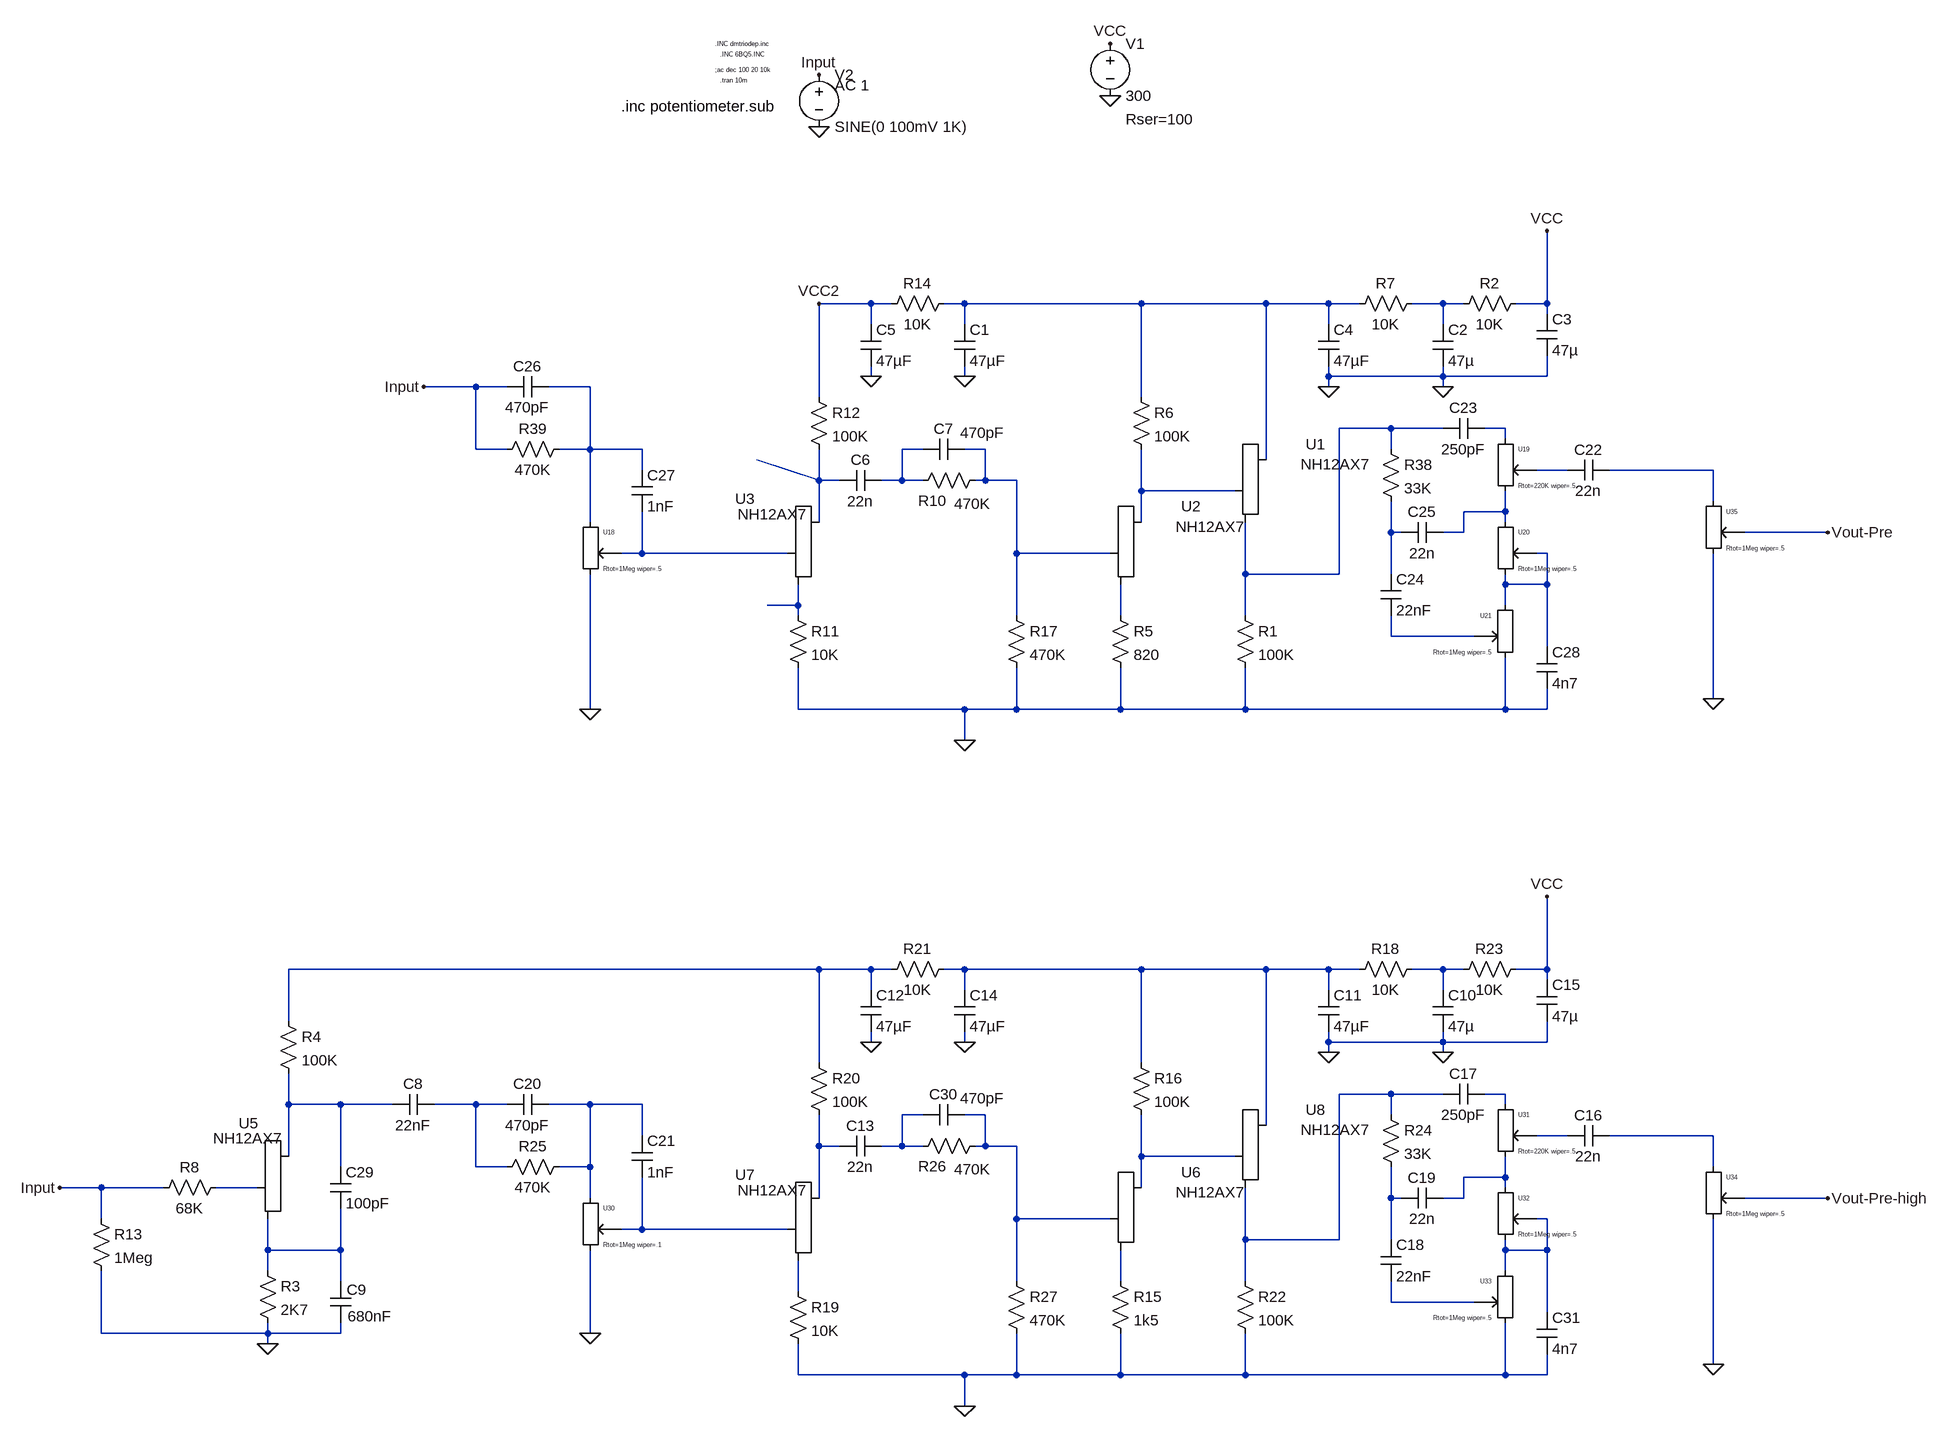
[diagram p0: schematic marshall_JCM800_50W_4010.asc]
marshall_JCM800_50W_4010.asc, the LTspice schematic file:
Version 4
SHEET 1 1260 1524
WIRE -720 -224 -800 -224
WIRE -688 -224 -720 -224
WIRE -576 -224 -608 -224
WIRE -304 -224 -576 -224
WIRE -112 -224 -304 -224
WIRE -16 -224 -112 -224
WIRE 32 -224 -16 -224
WIRE 160 -224 112 -224
WIRE 192 -224 160 -224
WIRE 320 -224 320 -336
WIRE 320 -224 272 -224
WIRE 320 -208 320 -224
WIRE -720 -192 -720 -224
WIRE -576 -192 -576 -224
WIRE -16 -192 -16 -224
WIRE 160 -192 160 -224
WIRE -720 -112 -720 -128
WIRE -576 -112 -576 -128
WIRE -16 -112 -16 -128
WIRE 160 -112 160 -128
WIRE 160 -112 -16 -112
WIRE 320 -112 320 -144
WIRE 320 -112 160 -112
WIRE -1328 -96 -1408 -96
WIRE -1280 -96 -1328 -96
WIRE -1152 -96 -1216 -96
WIRE -16 -96 -16 -112
WIRE 160 -96 160 -112
WIRE -800 -80 -800 -224
WIRE -304 -80 -304 -224
WIRE 80 -32 0 -32
WIRE 160 -32 80 -32
WIRE 256 -32 224 -32
WIRE 256 -16 256 -32
WIRE -1328 0 -1328 -96
WIRE -1280 0 -1328 0
WIRE -1152 0 -1152 -96
WIRE -1152 0 -1200 0
WIRE -1072 0 -1152 0
WIRE -640 0 -672 0
WIRE -544 0 -576 0
WIRE 80 0 80 -32
WIRE -112 16 -112 -224
WIRE -1072 32 -1072 0
WIRE 352 32 304 32
WIRE 576 32 416 32
WIRE -800 48 -800 0
WIRE -800 48 -896 16
WIRE -768 48 -800 48
WIRE -672 48 -672 0
WIRE -672 48 -704 48
WIRE -640 48 -672 48
WIRE -544 48 -544 0
WIRE -544 48 -560 48
WIRE -496 48 -544 48
WIRE -304 64 -304 0
WIRE -160 64 -304 64
WIRE 576 80 576 32
WIRE 256 96 256 64
WIRE 256 96 192 96
WIRE -1152 112 -1152 0
WIRE -800 112 -800 48
WIRE -304 112 -304 64
WIRE 256 112 256 96
WIRE 80 128 80 80
WIRE 96 128 80 128
WIRE 192 128 192 96
WIRE 192 128 160 128
WIRE 752 128 624 128
WIRE -1072 160 -1072 96
WIRE -1072 160 -1104 160
WIRE -848 160 -1072 160
WIRE -496 160 -496 48
WIRE -352 160 -496 160
WIRE 320 160 304 160
WIRE -144 192 -144 112
WIRE 0 192 0 -32
WIRE 0 192 -144 192
WIRE 80 192 80 128
WIRE 256 208 256 192
WIRE 320 208 320 160
WIRE 320 208 256 208
WIRE -832 240 -832 208
WIRE -832 240 -880 240
WIRE 256 240 256 208
WIRE -832 256 -832 240
WIRE -496 256 -496 160
WIRE -336 256 -336 208
WIRE -144 256 -144 192
WIRE 80 288 80 256
WIRE 208 288 80 288
WIRE 320 304 320 208
WIRE 576 384 576 160
WIRE -1152 400 -1152 192
WIRE -832 400 -832 336
WIRE -576 400 -832 400
WIRE -496 400 -496 336
WIRE -496 400 -576 400
WIRE -336 400 -336 336
WIRE -336 400 -496 400
WIRE -144 400 -144 336
WIRE -144 400 -336 400
WIRE 256 400 256 320
WIRE 256 400 -144 400
WIRE 320 400 320 368
WIRE 320 400 256 400
WIRE -576 448 -576 400
WIRE -800 800 -1616 800
WIRE -720 800 -800 800
WIRE -688 800 -720 800
WIRE -576 800 -608 800
WIRE -304 800 -576 800
WIRE -112 800 -304 800
WIRE -16 800 -112 800
WIRE 32 800 -16 800
WIRE 160 800 112 800
WIRE 192 800 160 800
WIRE 320 800 320 688
WIRE 320 800 272 800
WIRE 320 816 320 800
WIRE -720 832 -720 800
WIRE -576 832 -576 800
WIRE -16 832 -16 800
WIRE 160 832 160 800
WIRE -1616 880 -1616 800
WIRE -720 912 -720 896
WIRE -576 912 -576 896
WIRE -16 912 -16 896
WIRE 160 912 160 896
WIRE 160 912 -16 912
WIRE 320 912 320 880
WIRE 320 912 160 912
WIRE -16 928 -16 912
WIRE 160 928 160 912
WIRE -800 944 -800 800
WIRE -304 944 -304 800
WIRE 80 992 0 992
WIRE 160 992 80 992
WIRE 256 992 224 992
WIRE -1616 1008 -1616 960
WIRE -1536 1008 -1616 1008
WIRE -1456 1008 -1536 1008
WIRE -1328 1008 -1392 1008
WIRE -1280 1008 -1328 1008
WIRE -1152 1008 -1216 1008
WIRE -1072 1008 -1152 1008
WIRE 256 1008 256 992
WIRE -640 1024 -672 1024
WIRE -544 1024 -576 1024
WIRE 80 1024 80 992
WIRE -112 1040 -112 800
WIRE -1072 1056 -1072 1008
WIRE 352 1056 304 1056
WIRE 576 1056 416 1056
WIRE -800 1072 -800 1024
WIRE -768 1072 -800 1072
WIRE -672 1072 -672 1024
WIRE -672 1072 -704 1072
WIRE -640 1072 -672 1072
WIRE -544 1072 -544 1024
WIRE -544 1072 -560 1072
WIRE -496 1072 -544 1072
WIRE -1616 1088 -1616 1008
WIRE -304 1088 -304 1024
WIRE -160 1088 -304 1088
WIRE -1536 1104 -1536 1008
WIRE -1328 1104 -1328 1008
WIRE -1280 1104 -1328 1104
WIRE -1152 1104 -1152 1008
WIRE -1152 1104 -1200 1104
WIRE 576 1104 576 1056
WIRE 256 1120 256 1088
WIRE 256 1120 192 1120
WIRE -1904 1136 -1968 1136
WIRE -1808 1136 -1904 1136
WIRE -1664 1136 -1728 1136
WIRE -304 1136 -304 1088
WIRE 256 1136 256 1120
WIRE -1152 1152 -1152 1104
WIRE -800 1152 -800 1072
WIRE 80 1152 80 1104
WIRE 96 1152 80 1152
WIRE 192 1152 192 1120
WIRE 192 1152 160 1152
WIRE 752 1152 624 1152
WIRE -1904 1184 -1904 1136
WIRE -496 1184 -496 1072
WIRE -352 1184 -496 1184
WIRE 320 1184 304 1184
WIRE -1072 1200 -1072 1120
WIRE -1072 1200 -1104 1200
WIRE -848 1200 -1072 1200
WIRE -144 1216 -144 1136
WIRE 0 1216 0 992
WIRE 0 1216 -144 1216
WIRE 80 1216 80 1152
WIRE -1648 1232 -1648 1184
WIRE -1536 1232 -1536 1168
WIRE -1536 1232 -1648 1232
WIRE 256 1232 256 1216
WIRE 320 1232 320 1184
WIRE 320 1232 256 1232
WIRE -1648 1264 -1648 1232
WIRE 256 1264 256 1232
WIRE -1536 1280 -1536 1232
WIRE -496 1280 -496 1184
WIRE -336 1280 -336 1232
WIRE -144 1280 -144 1216
WIRE -832 1296 -832 1248
WIRE 80 1312 80 1280
WIRE 208 1312 80 1312
WIRE 320 1328 320 1232
WIRE -1904 1360 -1904 1264
WIRE -1648 1360 -1648 1344
WIRE -1648 1360 -1904 1360
WIRE -1536 1360 -1536 1344
WIRE -1536 1360 -1648 1360
WIRE -1152 1360 -1152 1232
WIRE -1648 1376 -1648 1360
WIRE 576 1408 576 1184
WIRE -832 1424 -832 1376
WIRE -576 1424 -832 1424
WIRE -496 1424 -496 1360
WIRE -496 1424 -576 1424
WIRE -336 1424 -336 1360
WIRE -336 1424 -496 1424
WIRE -144 1424 -144 1360
WIRE -144 1424 -336 1424
WIRE 256 1424 256 1344
WIRE 256 1424 -144 1424
WIRE 320 1424 320 1392
WIRE 320 1424 256 1424
WIRE -576 1472 -576 1424
FLAG 160 -96 0
FLAG -16 -96 0
FLAG -720 -112 0
FLAG -1408 -96 Input
FLAG -576 -112 0
FLAG -800 -576 Input
FLAG -800 -496 0
FLAG -576 448 0
FLAG -1648 1376 0
FLAG 752 128 Vout-Pre
FLAG -1152 400 0
FLAG 320 -336 VCC
FLAG -352 -624 VCC
FLAG -352 -544 0
FLAG -800 -224 VCC2
FLAG 160 928 0
FLAG -16 928 0
FLAG -720 912 0
FLAG -1968 1136 Input
FLAG -576 912 0
FLAG -576 1472 0
FLAG 752 1152 Vout-Pre-high
FLAG -1152 1360 0
FLAG 320 688 VCC
FLAG 576 384 0
FLAG 576 1408 0
DATAFLAG -432 -224 ""
DATAFLAG -304 64 ""
DATAFLAG -48 192 ""
DATAFLAG -1648 1216 ""
DATAFLAG -432 800 ""
DATAFLAG -208 1088 ""
DATAFLAG -96 1216 ""
DATAFLAG -880 240 ""
DATAFLAG -896 16 ""
SYMBOL voltage -352 -640 R0
WINDOW 123 24 112 Left 2
WINDOW 39 24 132 Left 2
SYMATTR SpiceLine Rser=100
SYMATTR InstName V1
SYMATTR Value 300
SYMBOL cap 144 -192 R0
SYMATTR InstName C2
SYMATTR Value 47µ
SYMBOL voltage -800 -592 R0
WINDOW 123 24 32 Left 2
WINDOW 39 0 0 Left 2
SYMATTR Value2 AC 1
SYMATTR InstName V2
SYMATTR Value SINE(0 100mV 1K)
SYMBOL triode -304 160 R0
WINDOW 0 61 -72 Left 2
WINDOW 3 61 -16 Invisible 2
WINDOW 38 53 -41 Left 2
SYMATTR InstName U2
SYMATTR Value ""
SYMATTR SpiceModel NH12AX7
SYMBOL res -352 240 R0
SYMATTR InstName R5
SYMATTR Value 820
SYMBOL res -320 -96 R0
SYMATTR InstName R6
SYMATTR Value 100K
SYMBOL res 16 -208 R270
WINDOW 0 32 56 VTop 2
WINDOW 3 0 56 VBottom 2
SYMATTR InstName R7
SYMATTR Value 10K
SYMBOL cap -32 -192 R0
SYMATTR InstName C4
SYMATTR Value 47µF
SYMBOL res -1824 1152 R270
WINDOW 0 32 56 VTop 2
WINDOW 3 0 56 VBottom 2
SYMATTR InstName R8
SYMATTR Value 68K
SYMBOL triode -800 160 R0
WINDOW 0 -129 -84 Left 2
WINDOW 3 61 -16 Invisible 2
WINDOW 38 -125 -60 Left 2
SYMATTR InstName U3
SYMATTR Value ""
SYMATTR SpiceModel NH12AX7
SYMBOL res -848 240 R0
SYMATTR InstName R11
SYMATTR Value 10K
SYMBOL res -816 -96 R0
SYMATTR InstName R12
SYMATTR Value 100K
SYMBOL res -704 -208 R270
WINDOW 0 32 56 VTop 2
WINDOW 3 0 56 VBottom 2
SYMATTR InstName R14
SYMATTR Value 10K
SYMBOL cap -736 -192 R0
SYMATTR InstName C5
SYMATTR Value 47µF
SYMBOL cap -768 64 R270
WINDOW 0 32 32 VTop 2
WINDOW 3 0 32 VBottom 2
SYMATTR InstName C6
SYMATTR Value 22n
SYMBOL cap -592 -192 R0
SYMATTR InstName C1
SYMATTR Value 47µF
SYMBOL triode -112 64 R0
WINDOW 0 61 -72 Left 2
WINDOW 3 61 -16 Invisible 2
WINDOW 38 53 -41 Left 2
SYMATTR InstName U1
SYMATTR Value ""
SYMATTR SpiceModel NH12AX7
SYMBOL res -160 240 R0
SYMATTR InstName R1
SYMATTR Value 100K
SYMBOL res 176 -208 R270
WINDOW 0 32 56 VTop 2
WINDOW 3 0 56 VBottom 2
SYMATTR InstName R2
SYMATTR Value 10K
SYMBOL cap 304 -208 R0
SYMATTR InstName C3
SYMATTR Value 47µ
SYMBOL triode -1616 1136 R0
WINDOW 0 -77 -99 Left 2
WINDOW 3 61 -16 Invisible 2
WINDOW 38 -116 -76 Left 2
SYMATTR InstName U5
SYMATTR Value ""
SYMATTR SpiceModel NH12AX7
SYMBOL res -1664 1248 R0
SYMATTR InstName R3
SYMATTR Value 2K7
SYMBOL res -1632 864 R0
SYMATTR InstName R4
SYMATTR Value 100K
SYMBOL cap -1520 1344 R180
WINDOW 0 -24 51 Left 2
WINDOW 3 -64 10 Left 2
SYMATTR InstName C9
SYMATTR Value 680nF
SYMBOL cap -1456 1024 R270
WINDOW 0 32 32 VTop 2
WINDOW 3 0 32 VBottom 2
SYMATTR InstName C8
SYMATTR Value 22nF
SYMBOL res -1920 1168 R0
SYMATTR InstName R13
SYMATTR Value 1Meg
SYMBOL cap 352 48 R270
WINDOW 0 32 32 VTop 2
WINDOW 3 0 32 VBottom 2
SYMATTR InstName C22
SYMATTR Value 22n
SYMBOL cap 160 -16 R270
WINDOW 0 32 32 VTop 2
WINDOW 3 0 32 VBottom 2
SYMATTR InstName C23
SYMATTR Value 250pF
SYMBOL res 64 -16 R0
SYMATTR InstName R38
SYMATTR Value 33K
SYMBOL cap 64 192 R0
SYMATTR InstName C24
SYMATTR Value 22nF
SYMBOL cap 96 144 R270
WINDOW 0 32 32 VTop 2
WINDOW 3 0 32 VBottom 2
SYMATTR InstName C25
SYMATTR Value 22n
SYMBOL res -1296 16 R270
WINDOW 0 32 56 VTop 2
WINDOW 3 0 56 VBottom 2
SYMATTR InstName R39
SYMATTR Value 470K
SYMBOL cap -1280 -80 R270
WINDOW 0 32 32 VTop 2
WINDOW 3 0 32 VBottom 2
SYMATTR InstName C26
SYMATTR Value 470pF
SYMBOL potentiometerEU -1168 96 R0
SYMATTR InstName U18
SYMATTR Value Rtot=1Meg wiper=.5
SYMBOL cap -1088 32 R0
SYMATTR InstName C27
SYMATTR Value 1nF
SYMBOL res -656 64 R270
WINDOW 0 -31 31 VTop 2
WINDOW 3 -4 92 VBottom 2
SYMATTR InstName R10
SYMATTR Value 470K
SYMBOL cap -640 16 R270
WINDOW 0 32 32 VTop 2
WINDOW 3 57 92 VBottom 2
SYMATTR InstName C7
SYMATTR Value 470pF
SYMBOL res -512 240 R0
SYMATTR InstName R17
SYMATTR Value 470K
SYMBOL potentiometerEU 240 -32 R0
SYMATTR InstName U19
SYMATTR Value Rtot=220K wiper=.5
SYMBOL potentiometerEU 240 96 R0
SYMATTR InstName U20
SYMATTR Value Rtot=1Meg wiper=.5
SYMBOL potentiometerEU 272 224 M0
SYMATTR InstName U21
SYMATTR Value Rtot=1Meg wiper=.5
SYMBOL cap 304 304 R0
SYMATTR InstName C28
SYMATTR Value 4n7
SYMBOL cap -1552 1104 R0
SYMATTR InstName C29
SYMATTR Value 100pF
SYMBOL cap 144 832 R0
SYMATTR InstName C10
SYMATTR Value 47µ
SYMBOL triode -304 1184 R0
WINDOW 0 61 -72 Left 2
WINDOW 3 61 -16 Invisible 2
WINDOW 38 53 -41 Left 2
SYMATTR InstName U6
SYMATTR Value ""
SYMATTR SpiceModel NH12AX7
SYMBOL res -352 1264 R0
SYMATTR InstName R15
SYMATTR Value 1k5
SYMBOL res -320 928 R0
SYMATTR InstName R16
SYMATTR Value 100K
SYMBOL res 16 816 R270
WINDOW 0 32 56 VTop 2
WINDOW 3 0 56 VBottom 2
SYMATTR InstName R18
SYMATTR Value 10K
SYMBOL cap -32 832 R0
SYMATTR InstName C11
SYMATTR Value 47µF
SYMBOL triode -800 1200 R0
WINDOW 0 -129 -84 Left 2
WINDOW 3 61 -16 Invisible 2
WINDOW 38 -125 -60 Left 2
SYMATTR InstName U7
SYMATTR Value ""
SYMATTR SpiceModel NH12AX7
SYMBOL res -848 1280 R0
SYMATTR InstName R19
SYMATTR Value 10K
SYMBOL res -816 928 R0
SYMATTR InstName R20
SYMATTR Value 100K
SYMBOL res -704 816 R270
WINDOW 0 32 56 VTop 2
WINDOW 3 0 56 VBottom 2
SYMATTR InstName R21
SYMATTR Value 10K
SYMBOL cap -736 832 R0
SYMATTR InstName C12
SYMATTR Value 47µF
SYMBOL cap -768 1088 R270
WINDOW 0 32 32 VTop 2
WINDOW 3 0 32 VBottom 2
SYMATTR InstName C13
SYMATTR Value 22n
SYMBOL cap -592 832 R0
SYMATTR InstName C14
SYMATTR Value 47µF
SYMBOL triode -112 1088 R0
WINDOW 0 61 -72 Left 2
WINDOW 3 61 -16 Invisible 2
WINDOW 38 53 -41 Left 2
SYMATTR InstName U8
SYMATTR Value ""
SYMATTR SpiceModel NH12AX7
SYMBOL res -160 1264 R0
SYMATTR InstName R22
SYMATTR Value 100K
SYMBOL res 176 816 R270
WINDOW 0 32 56 VTop 2
WINDOW 3 0 56 VBottom 2
SYMATTR InstName R23
SYMATTR Value 10K
SYMBOL cap 304 816 R0
SYMATTR InstName C15
SYMATTR Value 47µ
SYMBOL cap 352 1072 R270
WINDOW 0 32 32 VTop 2
WINDOW 3 0 32 VBottom 2
SYMATTR InstName C16
SYMATTR Value 22n
SYMBOL cap 160 1008 R270
WINDOW 0 32 32 VTop 2
WINDOW 3 0 32 VBottom 2
SYMATTR InstName C17
SYMATTR Value 250pF
SYMBOL res 64 1008 R0
SYMATTR InstName R24
SYMATTR Value 33K
SYMBOL cap 64 1216 R0
SYMATTR InstName C18
SYMATTR Value 22nF
SYMBOL cap 96 1168 R270
WINDOW 0 32 32 VTop 2
WINDOW 3 0 32 VBottom 2
SYMATTR InstName C19
SYMATTR Value 22n
SYMBOL res -1296 1120 R270
WINDOW 0 32 56 VTop 2
WINDOW 3 0 56 VBottom 2
SYMATTR InstName R25
SYMATTR Value 470K
SYMBOL cap -1280 1024 R270
WINDOW 0 32 32 VTop 2
WINDOW 3 0 32 VBottom 2
SYMATTR InstName C20
SYMATTR Value 470pF
SYMBOL potentiometerEU -1168 1136 R0
SYMATTR InstName U30
SYMATTR Value Rtot=1Meg wiper=.1
SYMBOL cap -1088 1056 R0
SYMATTR InstName C21
SYMATTR Value 1nF
SYMBOL res -656 1088 R270
WINDOW 0 -31 31 VTop 2
WINDOW 3 -4 92 VBottom 2
SYMATTR InstName R26
SYMATTR Value 470K
SYMBOL cap -640 1040 R270
WINDOW 0 32 32 VTop 2
WINDOW 3 57 92 VBottom 2
SYMATTR InstName C30
SYMATTR Value 470pF
SYMBOL res -512 1264 R0
SYMATTR InstName R27
SYMATTR Value 470K
SYMBOL potentiometerEU 240 992 R0
SYMATTR InstName U31
SYMATTR Value Rtot=220K wiper=.5
SYMBOL potentiometerEU 240 1120 R0
SYMATTR InstName U32
SYMATTR Value Rtot=1Meg wiper=.5
SYMBOL potentiometerEU 272 1248 M0
SYMATTR InstName U33
SYMATTR Value Rtot=1Meg wiper=.5
SYMBOL cap 304 1328 R0
SYMATTR InstName C31
SYMATTR Value 4n7
SYMBOL potentiometerEU 560 1088 R0
SYMATTR InstName U34
SYMATTR Value Rtot=1Meg wiper=.5
SYMBOL potentiometerEU 560 64 R0
SYMATTR InstName U35
SYMATTR Value Rtot=1Meg wiper=.5
TEXT -952 -568 Left 0 !.tran 10m
TEXT -952 -608 Left 0 !.INC 6BQ5.INC
TEXT -960 -584 Left 0 !;ac dec 100 20 10k
TEXT -960 -624 Left 0 !.INC dmtriodep.inc
TEXT -1104 -528 Left 2 !.inc potentiometer.sub

The netlist it stands for:
* marshall_JCM800_50W_4010.asc
V1 VCC 0 300 Rser=100
C2 N002 0 47µ
V2 Input 0 SINE(0 100mV 1K) AC 1
XU2 N011 N007 N017 NH12AX7
R5 N017 0 820
R6 N001 N011 100K
R7 N001 N002 10K
C4 N001 0 47µF
R8 Input N034 68K
XU3 N010 N014 N016 NH12AX7
R11 N016 0 10K
R12 VCC2 N010 100K
R14 VCC2 N001 10K
C5 VCC2 0 47µF
C6 N010 N006 22n
C1 N001 0 47µF
XU1 N001 N011 N004 NH12AX7
R1 N004 0 100K
R2 N002 VCC 10K
C3 VCC 0 47µ
XU5 N024 N034 N038 NH12AX7
R3 N038 0 2K7
R4 N019 N024 100K
C9 0 N038 680nF
C8 N024 N025 22nF
R13 Input 0 1Meg
C22 N008 N009 22n
C23 N004 N005 250pF
R38 N004 N013 33K
C24 N013 N018 22nF
C25 N013 N012 22n
R39 Input N003 470K
C26 Input N003 470pF
XU18 N003 0 N014 potentiometer Rtot=1Meg wiper=.5  ; pins A B C
C27 N003 N014 1nF
R10 N006 N007 470K
C7 N006 N007 470pF
R17 N007 0 470K
XU19 N005 N012 N008 potentiometer Rtot=220K wiper=.5  ; pins A B C
XU20 N012 N015 N015 potentiometer Rtot=1Meg wiper=.5  ; pins A B C
XU21 N015 0 N018 potentiometer Rtot=1Meg wiper=.5  ; pins A B C
C28 N015 0 4n7
C29 N024 N038 100pF
C10 N021 0 47µ
XU6 N032 N028 N039 NH12AX7
R15 N039 0 1k5
R16 N020 N032 100K
R18 N020 N021 10K
C11 N020 0 47µF
XU7 N031 N037 N040 NH12AX7
R19 N040 0 10K
R20 N019 N031 100K
R21 N019 N020 10K
C12 N019 0 47µF
C13 N031 N027 22n
C14 N020 0 47µF
XU8 N020 N032 N022 NH12AX7
R22 N022 0 100K
R23 N021 VCC 10K
C15 VCC 0 47µ
C16 N029 N030 22n
C17 N022 N023 250pF
R24 N022 N035 33K
C18 N035 N041 22nF
C19 N035 N033 22n
R25 N025 N026 470K
C20 N025 N026 470pF
XU30 N026 0 N037 potentiometer Rtot=1Meg wiper=.1  ; pins A B C
C21 N026 N037 1nF
R26 N027 N028 470K
C30 N027 N028 470pF
R27 N028 0 470K
XU31 N023 N033 N029 potentiometer Rtot=220K wiper=.5  ; pins A B C
XU32 N033 N036 N036 potentiometer Rtot=1Meg wiper=.5  ; pins A B C
XU33 N036 0 N041 potentiometer Rtot=1Meg wiper=.5  ; pins A B C
C31 N036 0 4n7
XU34 N030 0 Vout-Pre-high potentiometer Rtot=1Meg wiper=.5  ; pins A B C
XU35 N009 0 Vout-Pre potentiometer Rtot=1Meg wiper=.5  ; pins A B C
.tran 10m
.INC 6BQ5.INC
;ac dec 100 20 10k
.INC dmtriodep.inc
.inc potentiometer.sub
.backanno
.end